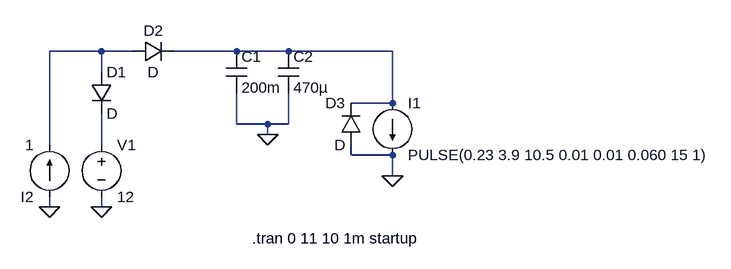
[diagram p0: schematic Contactor Coil.asc]
Contactor Coil.asc, the LTspice schematic file:
Version 4.1
SHEET 1 880 680
WIRE -192 128 -272 128
WIRE -144 128 -192 128
WIRE 16 128 -80 128
WIRE 96 128 16 128
WIRE 256 128 96 128
WIRE -192 160 -192 128
WIRE 256 208 256 128
WIRE 256 208 192 208
WIRE 16 240 16 192
WIRE 64 240 16 240
WIRE 96 240 96 192
WIRE 96 240 64 240
WIRE 64 256 64 240
WIRE -272 272 -272 128
WIRE -192 272 -192 224
WIRE 192 288 192 272
WIRE 256 288 192 288
WIRE 256 320 256 288
WIRE -272 368 -272 352
WIRE -192 368 -192 352
FLAG 256 320 0
FLAG -192 368 0
FLAG 64 256 0
FLAG -272 368 0
SYMBOL current 256 208 R0
WINDOW 123 0 0 Left 0
WINDOW 39 0 0 Left 0
SYMATTR InstName I1
SYMATTR Value PULSE(0.23 3.9 10.5 0.01 0.01 0.060 15 1)
SYMBOL voltage -192 256 R0
WINDOW 123 0 0 Left 0
WINDOW 39 24 124 Left 2
SYMATTR InstName V1
SYMATTR Value 12
SYMBOL cap 0 128 R0
WINDOW 3 24 56 Left 2
SYMATTR InstName C1
SYMATTR Value 200m
SYMATTR Description Capacitor
SYMATTR Type cap
SYMATTR SpiceLine V=16 Irms=590m Rser=0.146 Lser=3.1n
SYMBOL cap 80 128 R0
WINDOW 3 24 56 Left 2
SYMATTR InstName C2
SYMATTR Value 470µ
SYMATTR Description Capacitor
SYMATTR Type cap
SYMATTR SpiceLine V=16 Irms=590m Rser=0.146 Lser=3.1n mfg="Würth Elektronik" pn="865080353015 WCAP-ASLI 8x10,5" type="Al electrolytic"
SYMBOL current -272 352 R180
WINDOW 123 0 0 Left 0
WINDOW 39 0 0 Left 0
SYMATTR InstName I2
SYMATTR Value 1
SYMBOL diode -208 160 R0
SYMATTR InstName D1
SYMBOL diode -144 144 R270
WINDOW 0 32 32 VTop 2
WINDOW 3 0 32 VBottom 2
SYMATTR InstName D2
SYMBOL diode 208 272 R180
WINDOW 0 24 64 Left 2
WINDOW 3 24 0 Left 2
SYMATTR InstName D3
TEXT 40 416 Left 2 !.tran 0 11 10 1m startup

The netlist it stands for:
* Contactor Coil.asc
I1 N002 0 PULSE(0.23 3.9 10.5 0.01 0.01 0.060 15 1)
V1 N003 0 12
C1 N002 0 200m V=16 Irms=590m Rser=0.146 Lser=3.1n
C2 N002 0 470µ V=16 Irms=590m Rser=0.146 Lser=3.1n mfg="Würth Elektronik" pn="865080353015 WCAP-ASLI 8x10,5" type="Al electrolytic"
I2 0 N001 1
D1 N001 N003 D
D2 N001 N002 D
D3 0 N002 D
.model D D
.lib standard.dio
.tran 0 11 10 1m startup
.backanno
.end